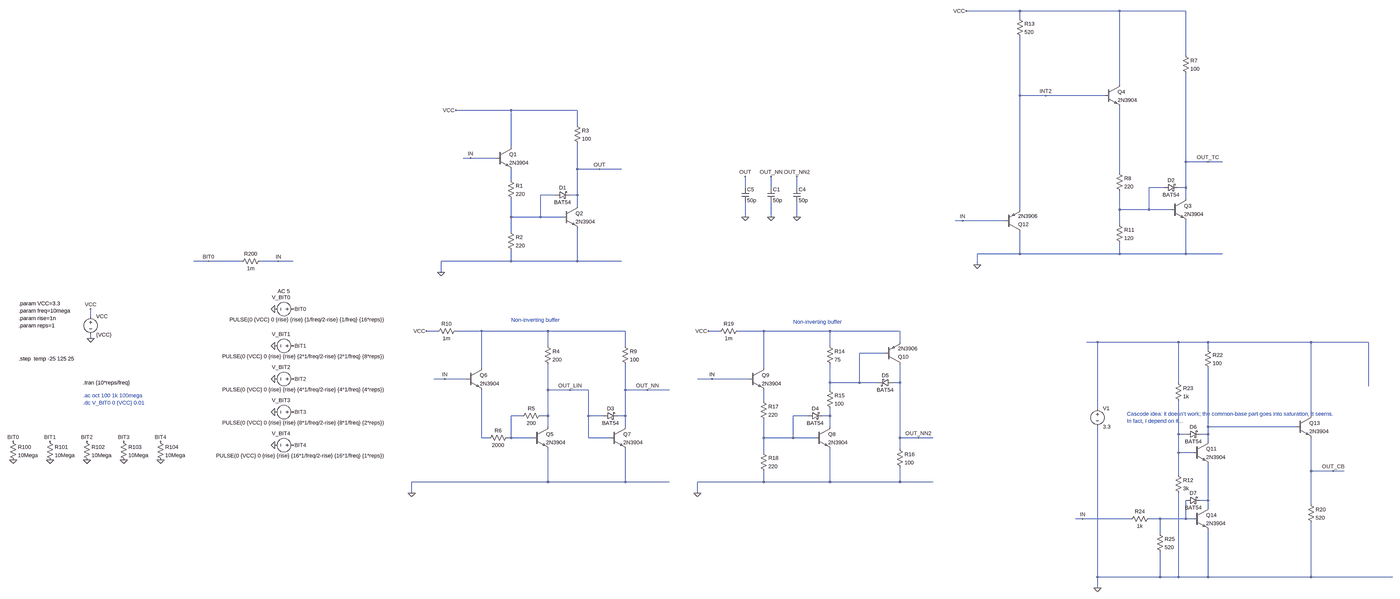
[diagram p0: schematic inverters.asc, whole sheet]
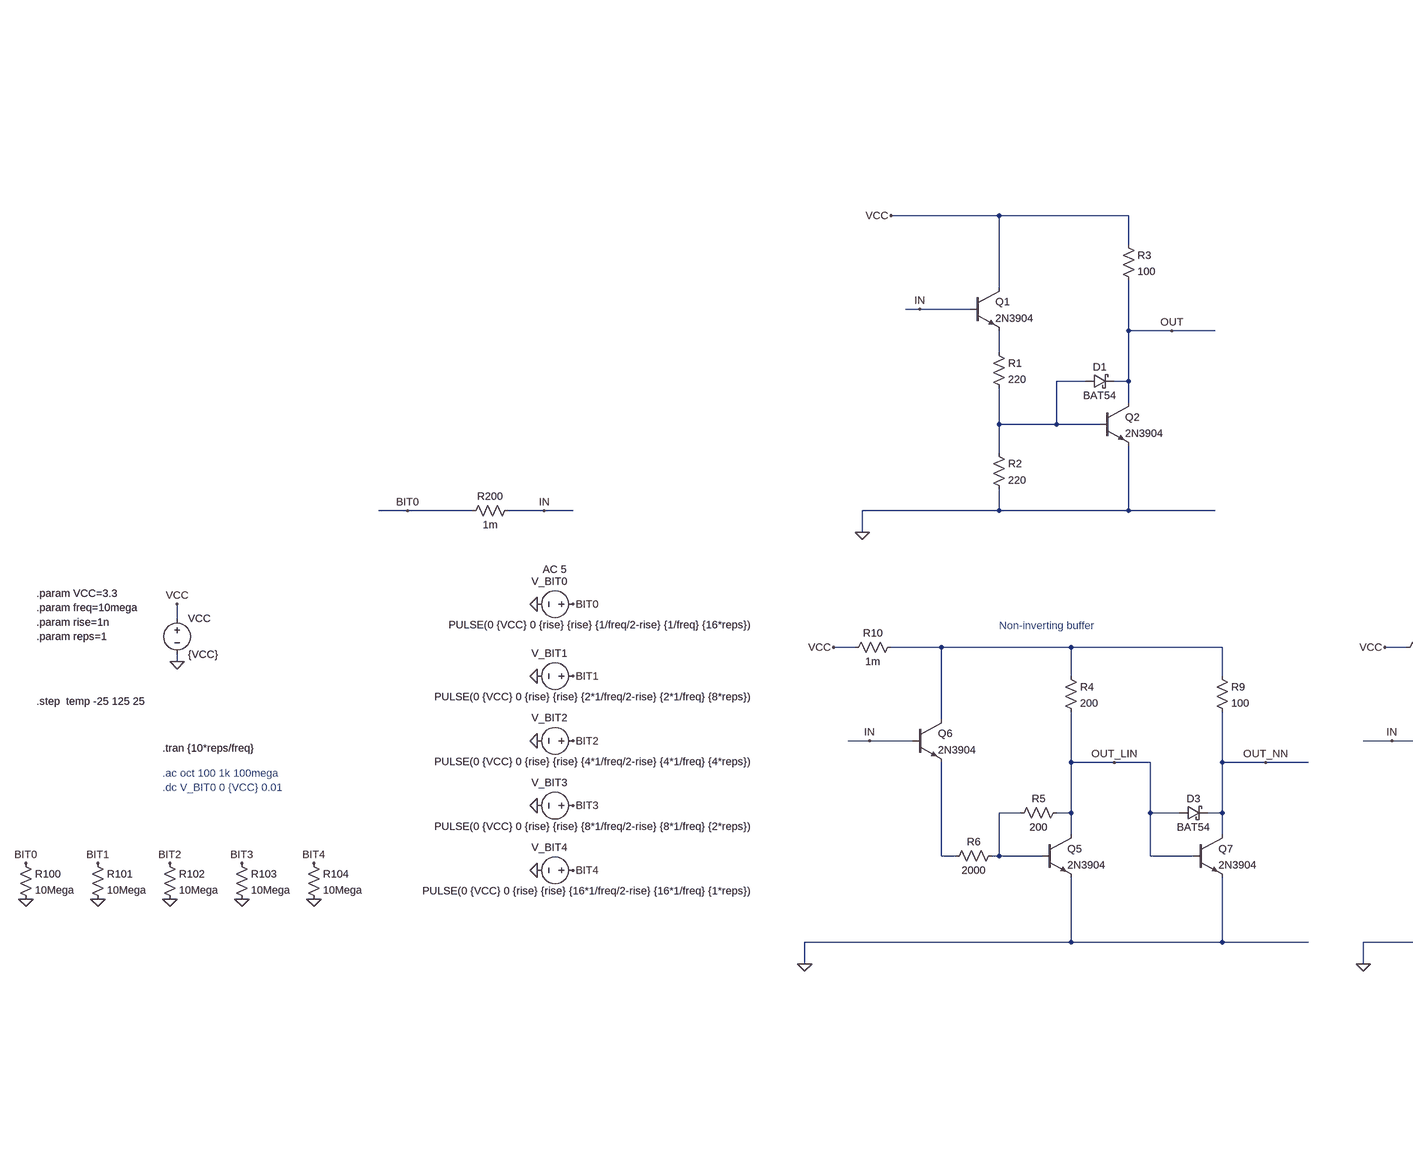
[diagram p1: schematic inverters.asc, part, row 1 of 1, column 1 of 2]
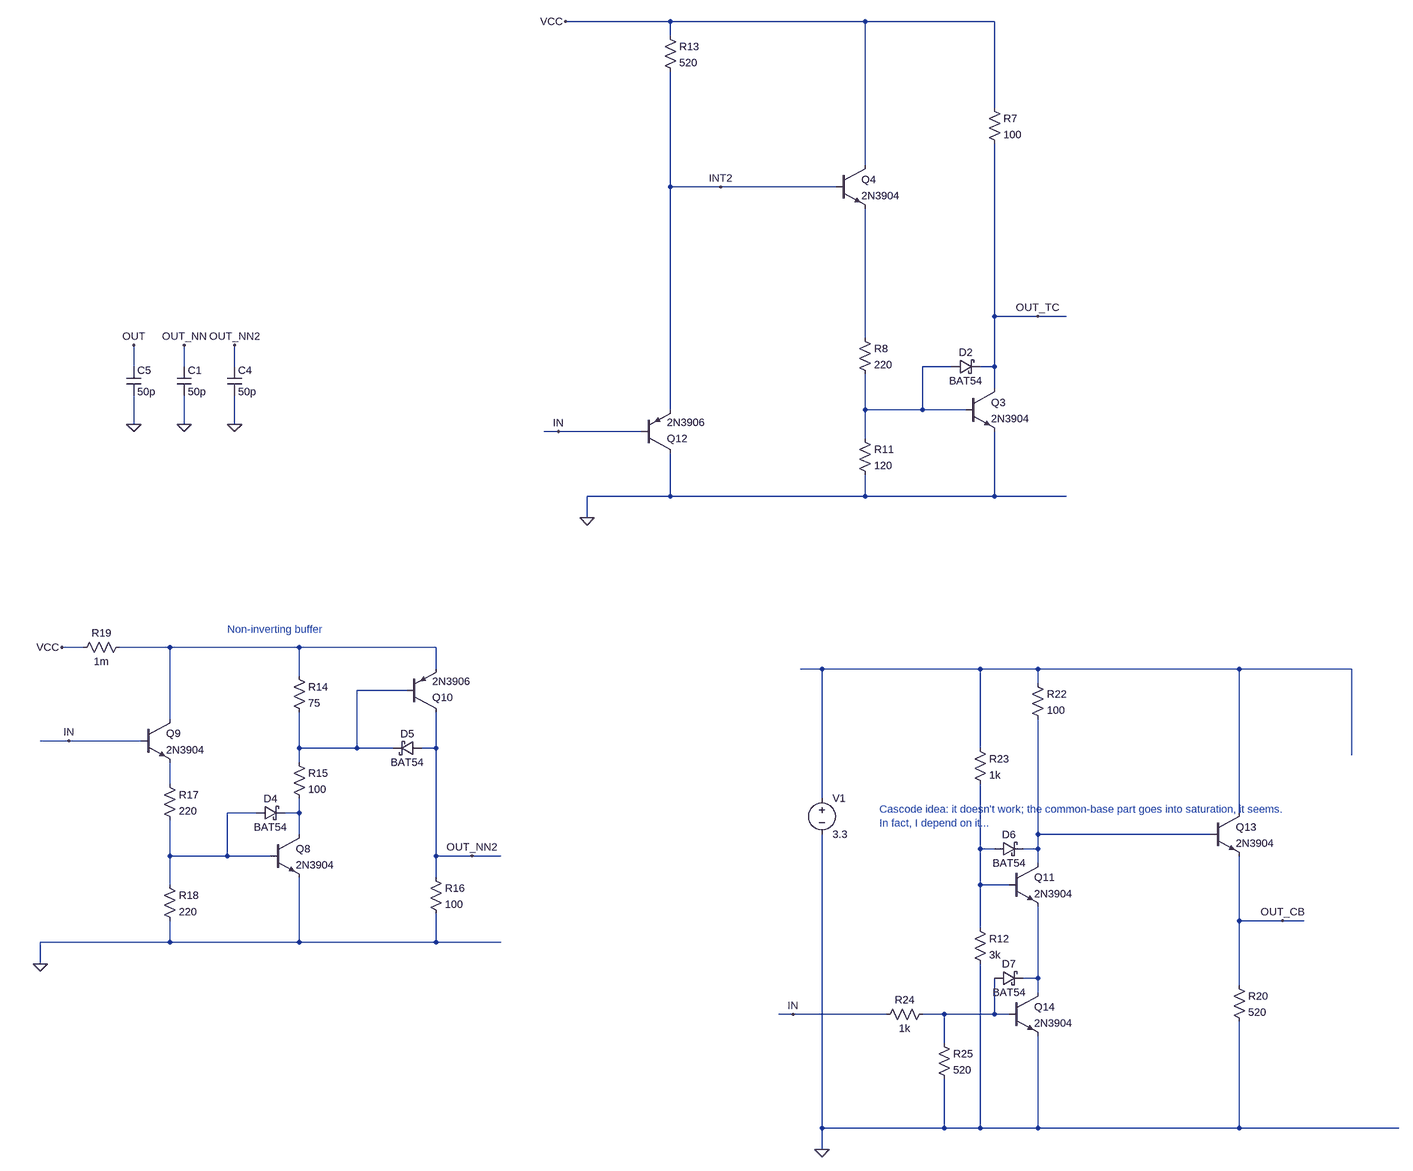
[diagram p2: schematic inverters.asc, part, row 1 of 1, column 2 of 2]
inverters.asc, the LTspice schematic file:
Version 4
SHEET 1 14868 10612
WIRE 4768 1616 4240 1616
WIRE 5216 1616 4768 1616
WIRE 5504 1616 5216 1616
WIRE 4768 1648 4768 1616
WIRE 5504 1808 5504 1616
WIRE 5216 1936 5216 1616
WIRE 4768 1984 4768 1728
WIRE 4880 1984 4768 1984
WIRE 5152 1984 4880 1984
WIRE 1936 2048 1696 2048
WIRE 2224 2048 1936 2048
WIRE 2224 2112 2224 2048
WIRE 1936 2208 1936 2048
WIRE 1760 2256 1728 2256
WIRE 1872 2256 1760 2256
WIRE 5504 2272 5504 1888
WIRE 5600 2272 5504 2272
WIRE 5664 2272 5600 2272
WIRE 2224 2304 2224 2192
WIRE 2320 2304 2224 2304
WIRE 2416 2304 2320 2304
WIRE 5216 2320 5216 2032
WIRE 1936 2352 1936 2304
WIRE 3280 2384 3280 2336
WIRE 3392 2384 3392 2336
WIRE 3504 2384 3504 2336
WIRE 5408 2384 5344 2384
WIRE 5504 2384 5504 2272
WIRE 5504 2384 5472 2384
WIRE 2128 2416 2064 2416
WIRE 2224 2416 2224 2304
WIRE 2224 2416 2192 2416
WIRE 5504 2432 5504 2384
WIRE 2224 2464 2224 2416
WIRE 4768 2480 4768 1984
WIRE 5216 2480 5216 2400
WIRE 5344 2480 5344 2384
WIRE 5344 2480 5216 2480
WIRE 5440 2480 5344 2480
WIRE 1936 2512 1936 2432
WIRE 2064 2512 2064 2416
WIRE 2064 2512 1936 2512
WIRE 2160 2512 2064 2512
WIRE 3280 2512 3280 2448
WIRE 3392 2512 3392 2448
WIRE 3504 2512 3504 2448
WIRE 4224 2528 4192 2528
WIRE 4704 2528 4224 2528
WIRE 5216 2544 5216 2480
WIRE 1936 2576 1936 2512
WIRE 4768 2672 4768 2576
WIRE 4768 2672 4288 2672
WIRE 5216 2672 5216 2624
WIRE 5216 2672 4768 2672
WIRE 5504 2672 5504 2528
WIRE 5504 2672 5216 2672
WIRE 5664 2672 5504 2672
WIRE 528 2704 464 2704
WIRE 672 2704 528 2704
WIRE 832 2704 752 2704
WIRE 896 2704 832 2704
WIRE 1936 2704 1936 2656
WIRE 1936 2704 1632 2704
WIRE 2224 2704 2224 2560
WIRE 2224 2704 1936 2704
WIRE 2416 2704 2224 2704
WIRE 4288 2720 4288 2672
WIRE 1632 2752 1632 2704
WIRE 16 2944 16 2912
WIRE 1616 3008 1568 3008
WIRE 1808 3008 1696 3008
WIRE 2096 3008 1808 3008
WIRE 2432 3008 2096 3008
WIRE 3168 3008 3120 3008
WIRE 3360 3008 3248 3008
WIRE 3648 3008 3360 3008
WIRE 3952 3008 3648 3008
WIRE 16 3040 16 3024
WIRE 3952 3056 3952 3008
WIRE 5120 3056 5072 3056
WIRE 5472 3056 5120 3056
WIRE 5600 3056 5472 3056
WIRE 6048 3056 5600 3056
WIRE 6336 3056 6048 3056
WIRE 2096 3072 2096 3008
WIRE 2432 3072 2432 3008
WIRE 3648 3072 3648 3008
WIRE 5600 3088 5600 3056
WIRE 3888 3104 3776 3104
WIRE 1808 3168 1808 3008
WIRE 3360 3168 3360 3008
WIRE 1648 3216 1600 3216
WIRE 1744 3216 1648 3216
WIRE 3136 3216 3072 3216
WIRE 3296 3216 3136 3216
WIRE 3648 3232 3648 3152
WIRE 3776 3232 3776 3104
WIRE 3776 3232 3648 3232
WIRE 3856 3232 3776 3232
WIRE 3952 3232 3952 3152
WIRE 3952 3232 3920 3232
WIRE 5472 3232 5472 3056
WIRE 6336 3248 6336 3056
WIRE 2096 3264 2096 3152
WIRE 2192 3264 2096 3264
WIRE 2272 3264 2192 3264
WIRE 2432 3264 2432 3152
WIRE 2528 3264 2432 3264
WIRE 2624 3264 2528 3264
WIRE 3648 3264 3648 3232
WIRE 3360 3312 3360 3264
WIRE 5120 3344 5120 3056
WIRE 1984 3376 1936 3376
WIRE 2096 3376 2096 3264
WIRE 2096 3376 2064 3376
WIRE 2272 3376 2272 3264
WIRE 2336 3376 2272 3376
WIRE 2432 3376 2432 3264
WIRE 2432 3376 2400 3376
WIRE 3552 3376 3488 3376
WIRE 3648 3376 3648 3344
WIRE 3648 3376 3616 3376
WIRE 6048 3376 6048 3056
WIRE 2096 3424 2096 3376
WIRE 2432 3424 2432 3376
WIRE 3648 3424 3648 3376
WIRE 5600 3424 5600 3168
WIRE 5984 3424 5600 3424
WIRE 5472 3456 5472 3312
WIRE 5504 3456 5472 3456
WIRE 5600 3456 5600 3424
WIRE 5600 3456 5568 3456
WIRE 1808 3472 1808 3264
WIRE 1840 3472 1808 3472
WIRE 1936 3472 1936 3376
WIRE 1936 3472 1920 3472
WIRE 2032 3472 1936 3472
WIRE 2272 3472 2272 3376
WIRE 2368 3472 2272 3472
WIRE 3360 3472 3360 3392
WIRE 3488 3472 3488 3376
WIRE 3488 3472 3360 3472
WIRE 3584 3472 3488 3472
WIRE 3952 3472 3952 3232
WIRE 4032 3472 3952 3472
WIRE 4096 3472 4032 3472
WIRE 5600 3488 5600 3456
WIRE 3952 3520 3952 3472
WIRE 3360 3536 3360 3472
WIRE 5472 3536 5472 3456
WIRE 5536 3536 5472 3536
WIRE 6048 3616 6048 3472
WIRE 6144 3616 6048 3616
WIRE 6192 3616 6144 3616
WIRE 5472 3632 5472 3536
WIRE 2096 3664 2096 3520
WIRE 2096 3664 1504 3664
WIRE 2432 3664 2432 3520
WIRE 2432 3664 2096 3664
WIRE 2624 3664 2432 3664
WIRE 3360 3664 3360 3616
WIRE 3360 3664 3072 3664
WIRE 3648 3664 3648 3520
WIRE 3648 3664 3360 3664
WIRE 3952 3664 3952 3600
WIRE 3952 3664 3648 3664
WIRE 4096 3664 3952 3664
WIRE 1504 3712 1504 3664
WIRE 3072 3712 3072 3664
WIRE 5600 3744 5600 3584
WIRE 5600 3744 5568 3744
WIRE 6048 3760 6048 3616
WIRE 5600 3776 5600 3744
WIRE 5056 3824 5024 3824
WIRE 5264 3824 5056 3824
WIRE 5392 3824 5344 3824
WIRE 5504 3824 5504 3744
WIRE 5504 3824 5392 3824
WIRE 5536 3824 5504 3824
WIRE 5392 3888 5392 3824
WIRE 5120 4112 5120 3424
WIRE 5392 4112 5392 3968
WIRE 5392 4112 5120 4112
WIRE 5472 4112 5472 3712
WIRE 5472 4112 5392 4112
WIRE 5600 4112 5600 3872
WIRE 5600 4112 5472 4112
WIRE 6048 4112 6048 3840
WIRE 6048 4112 5600 4112
WIRE 6496 4112 6048 4112
WIRE 5120 4160 5120 4112
FLAG 16 3040 0
FLAG 896 2912 BIT0
FLAG 16 2912 VCC
FLAG 816 2912 0
FLAG 896 3072 BIT1
FLAG 816 3072 0
FLAG 896 3216 BIT2
FLAG 816 3216 0
FLAG 896 3360 BIT3
FLAG 816 3360 0
FLAG 896 3504 BIT4
FLAG 816 3504 0
FLAG -320 3488 BIT0
FLAG -320 3568 0
FLAG -160 3488 BIT1
FLAG -160 3568 0
FLAG 0 3488 BIT2
FLAG 0 3568 0
FLAG 160 3488 BIT3
FLAG 160 3568 0
FLAG 320 3488 BIT4
FLAG 320 3568 0
FLAG 1632 2752 0
FLAG 2320 2304 OUT
FLAG 1760 2256 IN
FLAG 1696 2048 VCC
FLAG 528 2704 BIT0
FLAG 832 2704 IN
FLAG 1504 3712 0
FLAG 2192 3264 OUT_LIN
FLAG 1648 3216 IN
FLAG 1568 3008 VCC
FLAG 2528 3264 OUT_NN
FLAG 4032 3472 OUT_NN2
FLAG 3120 3008 VCC
FLAG 3072 3712 0
FLAG 3136 3216 IN
FLAG 3504 2512 0
FLAG 3504 2336 OUT_NN2
FLAG 3392 2512 0
FLAG 3392 2336 OUT_NN
FLAG 3280 2512 0
FLAG 3280 2336 OUT
FLAG 5600 2272 OUT_TC
FLAG 4880 1984 INT2
FLAG 4240 1616 VCC
FLAG 4224 2528 IN
FLAG 4288 2720 0
FLAG 6144 3616 OUT_CB
FLAG 5056 3824 IN
FLAG 5120 4160 0
SYMBOL voltage 16 2928 R0
WINDOW 123 0 0 Left 0
WINDOW 39 0 0 Left 0
SYMATTR InstName VCC
SYMATTR Value {VCC}
SYMBOL voltage 912 2912 R90
WINDOW 123 -77 30 VRight 2
WINDOW 39 0 0 Left 0
WINDOW 0 -51 28 VRight 2
WINDOW 3 46 -379 VRight 2
SYMATTR Value2 AC 5
SYMATTR InstName V_BIT0
SYMATTR Value PULSE(0 {VCC} 0 {rise} {rise} {1/freq/2-rise} {1/freq} {16*reps})
SYMBOL voltage 912 3072 R90
WINDOW 123 -77 30 VRight 2
WINDOW 39 0 0 Left 0
WINDOW 0 -51 28 VRight 2
WINDOW 3 46 -379 VRight 2
SYMATTR InstName V_BIT1
SYMATTR Value PULSE(0 {VCC} 0 {rise} {rise} {2*1/freq/2-rise} {2*1/freq} {8*reps})
SYMBOL voltage 912 3216 R90
WINDOW 123 -77 30 VRight 2
WINDOW 39 0 0 Left 0
WINDOW 0 -51 28 VRight 2
WINDOW 3 46 -379 VRight 2
SYMATTR InstName V_BIT2
SYMATTR Value PULSE(0 {VCC} 0 {rise} {rise} {4*1/freq/2-rise} {4*1/freq} {4*reps})
SYMBOL voltage 912 3360 R90
WINDOW 123 -77 30 VRight 2
WINDOW 39 0 0 Left 0
WINDOW 0 -51 28 VRight 2
WINDOW 3 46 -379 VRight 2
SYMATTR InstName V_BIT3
SYMATTR Value PULSE(0 {VCC} 0 {rise} {rise} {8*1/freq/2-rise} {8*1/freq} {2*reps})
SYMBOL voltage 912 3504 R90
WINDOW 123 -77 30 VRight 2
WINDOW 39 0 0 Left 0
WINDOW 0 -51 28 VRight 2
WINDOW 3 46 -379 VRight 2
SYMATTR InstName V_BIT4
SYMATTR Value PULSE(0 {VCC} 0 {rise} {rise} {16*1/freq/2-rise} {16*1/freq} {1*reps})
SYMBOL res -336 3472 R0
SYMATTR InstName R100
SYMATTR Value 10Mega
SYMBOL res -176 3472 R0
SYMATTR InstName R101
SYMATTR Value 10Mega
SYMBOL res -16 3472 R0
SYMATTR InstName R102
SYMATTR Value 10Mega
SYMBOL res 144 3472 R0
SYMATTR InstName R103
SYMATTR Value 10Mega
SYMBOL res 304 3472 R0
SYMATTR InstName R104
SYMATTR Value 10Mega
SYMBOL npn 2160 2464 R0
SYMATTR InstName Q2
SYMATTR Value 2N3904
SYMBOL schottky 2128 2432 R270
WINDOW 0 32 32 VTop 2
WINDOW 3 0 32 VBottom 2
SYMATTR InstName D1
SYMATTR Value BAT54
SYMATTR Description Diode
SYMATTR Type diode
SYMBOL npn 1872 2208 R0
SYMATTR InstName Q1
SYMATTR Value 2N3904
SYMBOL res 2208 2096 R0
SYMATTR InstName R3
SYMATTR Value 100
SYMBOL res 1920 2336 R0
SYMATTR InstName R1
SYMATTR Value 220
SYMBOL res 1920 2560 R0
SYMATTR InstName R2
SYMATTR Value 220
SYMBOL res 768 2688 R90
WINDOW 0 0 56 VBottom 2
WINDOW 3 32 56 VTop 2
SYMATTR InstName R200
SYMATTR Value 1m
SYMBOL npn 2032 3424 R0
SYMATTR InstName Q5
SYMATTR Value 2N3904
SYMBOL npn 1744 3168 R0
SYMATTR InstName Q6
SYMATTR Value 2N3904
SYMBOL res 2080 3056 R0
SYMATTR InstName R4
SYMATTR Value 200
SYMBOL res 2080 3360 R90
WINDOW 0 0 56 VBottom 2
WINDOW 3 32 56 VTop 2
SYMATTR InstName R5
SYMATTR Value 200
SYMBOL res 1936 3456 R90
WINDOW 0 0 56 VBottom 2
WINDOW 3 32 56 VTop 2
SYMATTR InstName R6
SYMATTR Value 2000
SYMBOL npn 2368 3424 R0
SYMATTR InstName Q7
SYMATTR Value 2N3904
SYMBOL schottky 2336 3392 R270
WINDOW 0 32 32 VTop 2
WINDOW 3 0 32 VBottom 2
SYMATTR InstName D3
SYMATTR Value BAT54
SYMATTR Description Diode
SYMATTR Type diode
SYMBOL res 2416 3056 R0
SYMATTR InstName R9
SYMATTR Value 100
SYMBOL res 1712 2992 R90
WINDOW 0 0 56 VBottom 2
WINDOW 3 32 56 VTop 2
SYMATTR InstName R10
SYMATTR Value 1m
SYMBOL npn 3584 3424 R0
SYMATTR InstName Q8
SYMATTR Value 2N3904
SYMBOL schottky 3552 3392 R270
WINDOW 0 32 32 VTop 2
WINDOW 3 0 32 VBottom 2
SYMATTR InstName D4
SYMATTR Value BAT54
SYMATTR Description Diode
SYMATTR Type diode
SYMBOL npn 3296 3168 R0
SYMATTR InstName Q9
SYMATTR Value 2N3904
SYMBOL res 3632 3056 R0
SYMATTR InstName R14
SYMATTR Value 75
SYMBOL schottky 3920 3216 R90
WINDOW 0 0 32 VBottom 2
WINDOW 3 32 32 VTop 2
SYMATTR InstName D5
SYMATTR Value BAT54
SYMATTR Description Diode
SYMATTR Type diode
SYMBOL pnp 3888 3152 M180
SYMATTR InstName Q10
SYMATTR Value 2N3906
SYMBOL res 3632 3248 R0
SYMATTR InstName R15
SYMATTR Value 100
SYMBOL res 3936 3504 R0
SYMATTR InstName R16
SYMATTR Value 100
SYMBOL res 3344 3296 R0
SYMATTR InstName R17
SYMATTR Value 220
SYMBOL res 3344 3520 R0
SYMATTR InstName R18
SYMATTR Value 220
SYMBOL res 3264 2992 R90
WINDOW 0 0 56 VBottom 2
WINDOW 3 32 56 VTop 2
SYMATTR InstName R19
SYMATTR Value 1m
SYMBOL cap 3488 2384 R0
SYMATTR InstName C4
SYMATTR Value 50p
SYMBOL cap 3376 2384 R0
SYMATTR InstName C1
SYMATTR Value 50p
SYMBOL cap 3264 2384 R0
SYMATTR InstName C5
SYMATTR Value 50p
SYMBOL npn 5440 2432 R0
SYMATTR InstName Q3
SYMATTR Value 2N3904
SYMBOL schottky 5408 2400 R270
WINDOW 0 32 32 VTop 2
WINDOW 3 0 32 VBottom 2
SYMATTR InstName D2
SYMATTR Value BAT54
SYMATTR Description Diode
SYMATTR Type diode
SYMBOL npn 5152 1936 R0
SYMATTR InstName Q4
SYMATTR Value 2N3904
SYMBOL res 5488 1792 R0
SYMATTR InstName R7
SYMATTR Value 100
SYMBOL res 5200 2304 R0
SYMATTR InstName R8
SYMATTR Value 220
SYMBOL res 5200 2528 R0
SYMATTR InstName R11
SYMATTR Value 120
SYMBOL pnp 4704 2576 M180
SYMATTR InstName Q12
SYMATTR Value 2N3906
SYMBOL res 4752 1632 R0
SYMATTR InstName R13
SYMATTR Value 520
SYMBOL npn 5984 3376 R0
SYMATTR InstName Q13
SYMATTR Value 2N3904
SYMBOL res 5456 3616 R0
SYMATTR InstName R12
SYMATTR Value 3k
SYMBOL res 6032 3744 R0
SYMATTR InstName R20
SYMATTR Value 520
SYMBOL res 5584 3072 R0
SYMATTR InstName R22
SYMATTR Value 100
SYMBOL res 5456 3216 R0
SYMATTR InstName R23
SYMATTR Value 1k
SYMBOL voltage 5120 3328 R0
SYMATTR InstName V1
SYMATTR Value 3.3
SYMBOL npn 5536 3488 R0
SYMATTR InstName Q11
SYMATTR Value 2N3904
SYMBOL npn 5536 3776 R0
SYMATTR InstName Q14
SYMATTR Value 2N3904
SYMBOL res 5360 3808 R90
WINDOW 0 0 56 VBottom 2
WINDOW 3 32 56 VTop 2
SYMATTR InstName R24
SYMATTR Value 1k
SYMBOL res 5376 3872 R0
SYMATTR InstName R25
SYMATTR Value 520
SYMBOL schottky 5504 3472 R270
WINDOW 0 32 32 VTop 2
WINDOW 3 0 32 VBottom 2
SYMATTR InstName D6
SYMATTR Value BAT54
SYMATTR Description Diode
SYMATTR Type diode
SYMBOL schottky 5504 3760 R270
WINDOW 0 32 32 VTop 2
WINDOW 3 0 32 VBottom 2
SYMATTR InstName D7
SYMATTR Value BAT54
SYMATTR Description Diode
SYMATTR Type diode
TEXT -16 3232 Left 2 !.tran {10*reps/freq}
TEXT -16 3288 Left 2 ;.ac oct 100 1k 100mega
TEXT -16 3320 Left 2 ;.dc V_BIT0 0 {VCC} 0.01
TEXT -296 2888 Left 2 !.param VCC=3.3
TEXT -296 2920 Left 2 !.param freq=10mega
TEXT -296 2952 Left 2 !.param rise=1n
TEXT -296 2984 Left 2 !.param reps=1
TEXT -296 3128 Left 2 !.step  temp -25 125 25
TEXT 1936 2960 Left 2 ;Non-inverting buffer
TEXT 3488 2968 Left 2 ;Non-inverting buffer
TEXT 5248 3368 Left 2 ;Cascode idea: it doesn't work; the common-base part goes into saturation, it seems.\nIn fact, I depend on it...

The netlist it stands for:
* inverters.asc
VCC VCC 0 {VCC}
V_BIT0 BIT0 0 PULSE(0 {VCC} 0 {rise} {rise} {1/freq/2-rise} {1/freq} {16*reps}) AC 5
V_BIT1 BIT1 0 PULSE(0 {VCC} 0 {rise} {rise} {2*1/freq/2-rise} {2*1/freq} {8*reps})
V_BIT2 BIT2 0 PULSE(0 {VCC} 0 {rise} {rise} {4*1/freq/2-rise} {4*1/freq} {4*reps})
V_BIT3 BIT3 0 PULSE(0 {VCC} 0 {rise} {rise} {8*1/freq/2-rise} {8*1/freq} {2*reps})
V_BIT4 BIT4 0 PULSE(0 {VCC} 0 {rise} {rise} {16*1/freq/2-rise} {16*1/freq} {1*reps})
R100 BIT0 0 10Mega
R101 BIT1 0 10Mega
R102 BIT2 0 10Mega
R103 BIT3 0 10Mega
R104 BIT4 0 10Mega
Q2 OUT N004 0 0 2N3904
D1 N004 OUT BAT54
Q1 VCC IN N002 0 2N3904
R3 VCC OUT 100
R1 N002 N004 220
R2 N004 0 220
R200 IN BIT0 1m
Q5 OUT_LIN N010 0 0 2N3904
Q6 N005 IN N015 0 2N3904
R4 N005 OUT_LIN 200
R5 OUT_LIN N010 200
R6 N010 N015 2000
Q7 OUT_NN OUT_LIN 0 0 2N3904
D3 OUT_LIN OUT_NN BAT54
R9 N005 OUT_NN 100
R10 N005 VCC 1m
Q8 N012 N011 0 0 2N3904
D4 N011 N012 BAT54
Q9 N006 IN N009 0 2N3904
R14 N006 N008 75
D5 OUT_NN2 N008 BAT54
Q10 OUT_NN2 N008 N006 0 2N3906
R15 N008 N012 100
R16 OUT_NN2 0 100
R17 N009 N011 220
R18 N011 0 220
R19 N006 VCC 1m
C4 OUT_NN2 0 50p
C1 OUT_NN 0 50p
C5 OUT 0 50p
Q3 OUT_TC N003 0 0 2N3904
D2 N003 OUT_TC BAT54
Q4 VCC INT2 N001 0 2N3904
R7 VCC OUT_TC 100
R8 N001 N003 220
R11 N003 0 120
Q12 0 IN INT2 0 2N3906
R13 VCC INT2 520
Q13 N007 N013 OUT_CB 0 2N3904
R12 N014 0 3k
R20 OUT_CB 0 520
R22 N007 N013 100
R23 N007 N014 1k
V1 N007 0 3.3
Q11 N013 N014 N016 0 2N3904
Q14 N016 N017 0 0 2N3904
R24 N017 IN 1k
R25 N017 0 520
D6 N014 N013 BAT54
D7 N017 N016 BAT54
.model D D
.lib standard.dio
.model NPN NPN
.model PNP PNP
.lib standard.bjt
.tran {10*reps/freq}
* .ac oct 100 1k 100mega
* .dc V_BIT0 0 {VCC} 0.01
.param VCC=3.3
.param freq=10mega
.param rise=1n
.param reps=1
.step  temp -25 125 25
* Non-inverting buffer
* Non-inverting buffer
* Cascode idea: it doesn't work; the common-base part goes into saturation, it seems.
* In fact, I depend on it...
.backanno
.end